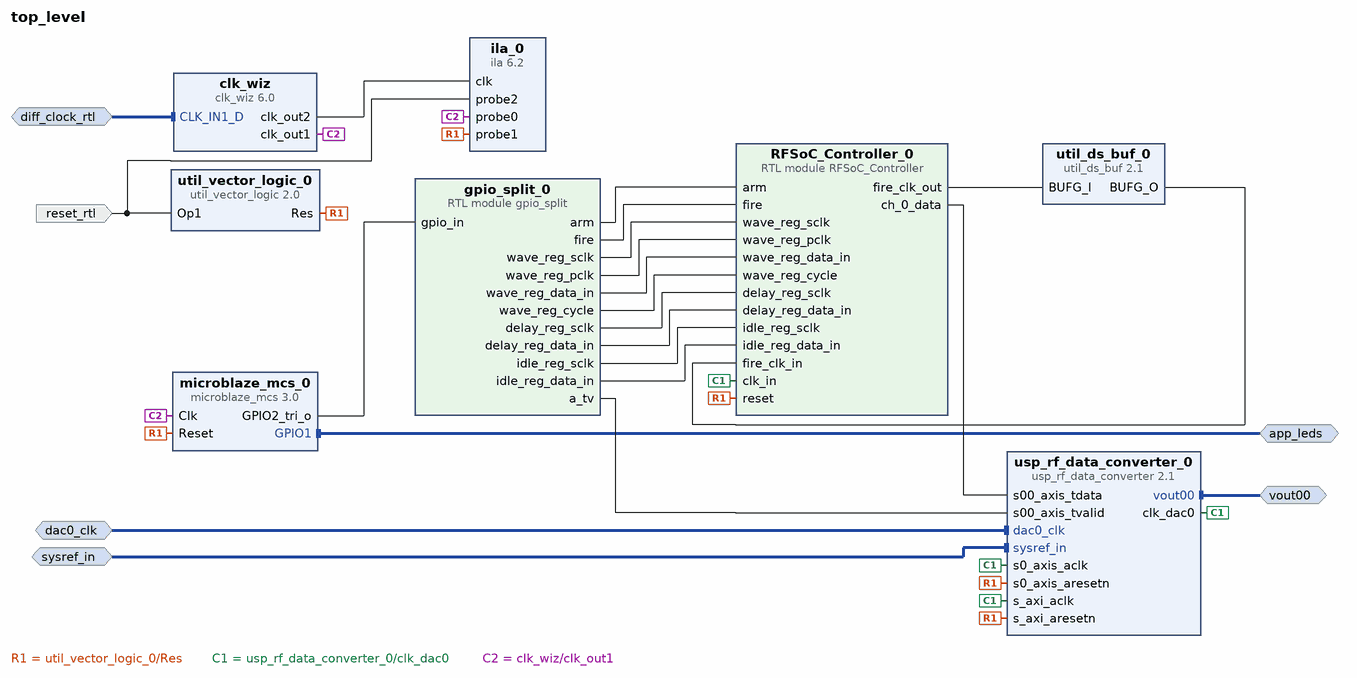
[diagram p0: block diagram of the top level]
# Vivado block design top_level, xczu29dr-ffvf1760-2-e, Vivado 2019.1
create_bd_design top_level

create_bd_intf_port -mode Slave -vlnv xilinx.com:interface:diff_clock_rtl:1.0 diff_clock_rtl
set_property -dict {CONFIG.FREQ_HZ 300000000} [get_bd_intf_ports diff_clock_rtl]
create_bd_intf_port -mode Master -vlnv xilinx.com:interface:gpio_rtl:1.0 app_leds
create_bd_intf_port -mode Slave -vlnv xilinx.com:display_usp_rf_data_converter:diff_pins_rtl:1.0 sysref_in
create_bd_intf_port -mode Slave -vlnv xilinx.com:interface:diff_clock_rtl:1.0 dac0_clk
set_property -dict {CONFIG.FREQ_HZ 200000000.0} [get_bd_intf_ports dac0_clk]
create_bd_intf_port -mode Master -vlnv xilinx.com:interface:diff_analog_io_rtl:1.0 vout00
create_bd_port -dir I -type rst reset_rtl
set_property -dict {CONFIG.POLARITY ACTIVE_HIGH} [get_bd_ports reset_rtl]

create_bd_cell -type ip -vlnv xilinx.com:ip:microblaze_mcs:3.0 microblaze_mcs_0
set_property -dict [list \
  CONFIG.DEBUG_ENABLED 2 \
  CONFIG.GPIO1_BOARD_INTERFACE app_leds \
  CONFIG.GPO2_SIZE 16 \
  CONFIG.MEMSIZE 131072 \
  CONFIG.USE_BOARD_FLOW true \
  CONFIG.USE_GPO2 1 \
] [get_bd_cells microblaze_mcs_0]
create_bd_cell -type ip -vlnv xilinx.com:ip:clk_wiz:6.0 clk_wiz
set_property -dict [list \
  CONFIG.CLKIN1_JITTER_PS 33.330000000000005 \
  CONFIG.CLKOUT1_JITTER 101.475 \
  CONFIG.CLKOUT1_PHASE_ERROR 77.836 \
  CONFIG.CLKOUT2_JITTER 81.814 \
  CONFIG.CLKOUT2_PHASE_ERROR 77.836 \
  CONFIG.CLKOUT2_REQUESTED_OUT_FREQ 300.000 \
  CONFIG.CLKOUT2_USED true \
  CONFIG.MMCM_CLKFBOUT_MULT_F 4.000 \
  CONFIG.MMCM_CLKIN1_PERIOD 3.333 \
  CONFIG.MMCM_CLKIN2_PERIOD 10.0 \
  CONFIG.MMCM_CLKOUT1_DIVIDE 4 \
  CONFIG.NUM_OUT_CLKS 2 \
  CONFIG.PRIM_IN_FREQ 300.000 \
  CONFIG.PRIM_SOURCE Differential_clock_capable_pin \
  CONFIG.RESET_PORT reset \
  CONFIG.RESET_TYPE ACTIVE_HIGH \
  CONFIG.USE_LOCKED false \
  CONFIG.USE_RESET false \
] [get_bd_cells clk_wiz]
create_bd_cell -type ip -vlnv xilinx.com:ip:util_vector_logic:2.0 util_vector_logic_0
set_property -dict {CONFIG.C_OPERATION not CONFIG.C_SIZE 1} [get_bd_cells util_vector_logic_0]
create_bd_cell -type module -reference RFSoC_Controller RFSoC_Controller_0
create_bd_cell -type module -reference gpio_split gpio_split_0
create_bd_cell -type ip -vlnv xilinx.com:ip:util_ds_buf:2.1 util_ds_buf_0
set_property -dict {CONFIG.C_BUF_TYPE BUFG} [get_bd_cells util_ds_buf_0]
create_bd_cell -type ip -vlnv xilinx.com:ip:usp_rf_data_converter:2.1 usp_rf_data_converter_0
set_property -dict [list \
  CONFIG.ADC_Slice00_Enable false \
  CONFIG.Axiclk_Freq 31.25 \
  CONFIG.DAC0_Outclk_Freq 31.250 \
  CONFIG.DAC0_PLL_Enable true \
  CONFIG.DAC0_Refclk_Freq 200.000 \
  CONFIG.DAC0_Sampling_Rate 0.5 \
  CONFIG.DAC_Interpolation_Mode00 1 \
  CONFIG.DAC_Mixer_Type00 0 \
  CONFIG.DAC_Slice00_Enable true \
] [get_bd_cells usp_rf_data_converter_0]
create_bd_cell -type ip -vlnv xilinx.com:ip:ila:6.2 ila_0
set_property -dict {CONFIG.C_ENABLE_ILA_AXI_MON false CONFIG.C_MONITOR_TYPE Native CONFIG.C_NUM_OF_PROBES 3} [get_bd_cells ila_0]

# ---- connections ----

connect_bd_intf_net [get_bd_intf_ports dac0_clk] [get_bd_intf_pins usp_rf_data_converter_0/dac0_clk]
connect_bd_intf_net [get_bd_intf_ports vout00] [get_bd_intf_pins usp_rf_data_converter_0/vout00]
connect_bd_intf_net [get_bd_intf_ports app_leds] [get_bd_intf_pins microblaze_mcs_0/GPIO1]
connect_bd_intf_net [get_bd_intf_ports sysref_in] [get_bd_intf_pins usp_rf_data_converter_0/sysref_in]
connect_bd_intf_net [get_bd_intf_ports diff_clock_rtl] [get_bd_intf_pins clk_wiz/CLK_IN1_D]
connect_bd_net [get_bd_pins util_vector_logic_0/Res] \
  [get_bd_pins microblaze_mcs_0/Reset] [get_bd_pins RFSoC_Controller_0/reset] \
  [get_bd_pins usp_rf_data_converter_0/s_axi_aresetn] [get_bd_pins usp_rf_data_converter_0/s0_axis_aresetn] \
  [get_bd_pins ila_0/probe1]
connect_bd_net [get_bd_ports reset_rtl] [get_bd_pins util_vector_logic_0/Op1] [get_bd_pins ila_0/probe2]
connect_bd_net [get_bd_pins gpio_split_0/arm] [get_bd_pins RFSoC_Controller_0/arm]
connect_bd_net [get_bd_pins gpio_split_0/fire] [get_bd_pins RFSoC_Controller_0/fire]
connect_bd_net [get_bd_pins gpio_split_0/wave_reg_sclk] [get_bd_pins RFSoC_Controller_0/wave_reg_sclk]
connect_bd_net [get_bd_pins gpio_split_0/wave_reg_pclk] [get_bd_pins RFSoC_Controller_0/wave_reg_pclk]
connect_bd_net [get_bd_pins gpio_split_0/wave_reg_data_in] [get_bd_pins RFSoC_Controller_0/wave_reg_data_in]
connect_bd_net [get_bd_pins gpio_split_0/wave_reg_cycle] [get_bd_pins RFSoC_Controller_0/wave_reg_cycle]
connect_bd_net [get_bd_pins gpio_split_0/delay_reg_sclk] [get_bd_pins RFSoC_Controller_0/delay_reg_sclk]
connect_bd_net [get_bd_pins gpio_split_0/delay_reg_data_in] [get_bd_pins RFSoC_Controller_0/delay_reg_data_in]
connect_bd_net [get_bd_pins gpio_split_0/idle_reg_sclk] [get_bd_pins RFSoC_Controller_0/idle_reg_sclk]
connect_bd_net [get_bd_pins gpio_split_0/idle_reg_data_in] [get_bd_pins RFSoC_Controller_0/idle_reg_data_in]
connect_bd_net [get_bd_pins RFSoC_Controller_0/fire_clk_out] [get_bd_pins util_ds_buf_0/BUFG_I]
connect_bd_net [get_bd_pins util_ds_buf_0/BUFG_O] [get_bd_pins RFSoC_Controller_0/fire_clk_in]
connect_bd_net [get_bd_pins RFSoC_Controller_0/ch_0_data] [get_bd_pins usp_rf_data_converter_0/s00_axis_tdata]
connect_bd_net [get_bd_pins gpio_split_0/a_tv] [get_bd_pins usp_rf_data_converter_0/s00_axis_tvalid]
connect_bd_net [get_bd_pins usp_rf_data_converter_0/clk_dac0] \
  [get_bd_pins RFSoC_Controller_0/clk_in] [get_bd_pins usp_rf_data_converter_0/s0_axis_aclk] \
  [get_bd_pins usp_rf_data_converter_0/s_axi_aclk]
connect_bd_net [get_bd_pins microblaze_mcs_0/GPIO2_tri_o] [get_bd_pins gpio_split_0/gpio_in]
connect_bd_net [get_bd_pins clk_wiz/clk_out1] [get_bd_pins microblaze_mcs_0/Clk] [get_bd_pins ila_0/probe0]
connect_bd_net [get_bd_pins clk_wiz/clk_out2] [get_bd_pins ila_0/clk]

validate_bd_design
save_bd_design
